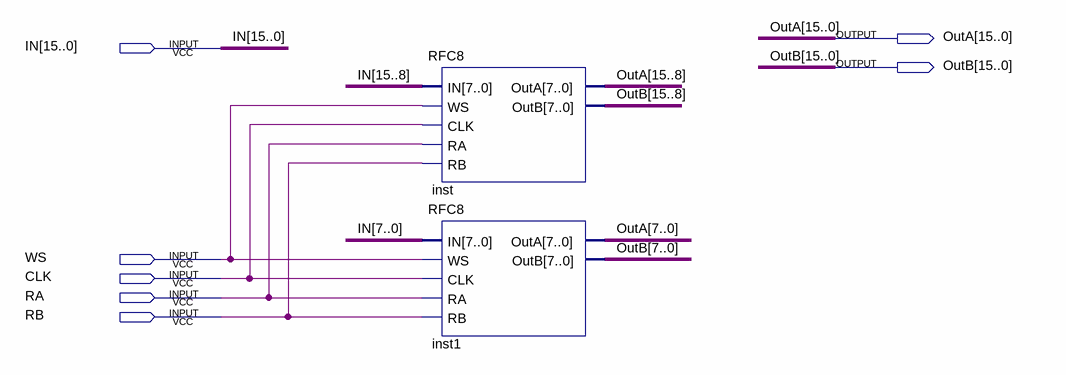
[diagram p0: schematic sheet]
// Quartus schematic RFC16.bdf as structural Verilog: 2 symbols, 7 pins
module RFC16 (
  input  [15:0] IN,
  input  WS,
  input  CLK,
  input  RA,
  input  RB,
  output [15:0] OutA,
  output [15:0] OutB
);

  RFC8 inst (.IN(IN[15:8]), .WS(WS), .CLK(CLK), .RA(RA), .RB(RB), .OutA(OutA[15:8]), .OutB(OutB[15:8]));
  RFC8 inst1 (.IN(IN[7:0]), .WS(WS), .CLK(CLK), .RA(RA), .RB(RB), .OutA(OutA[7:0]), .OutB(OutB[7:0]));
endmodule
